# EAGLE schematic GecikmeliAnahtar (EAGLE 9.6.2)
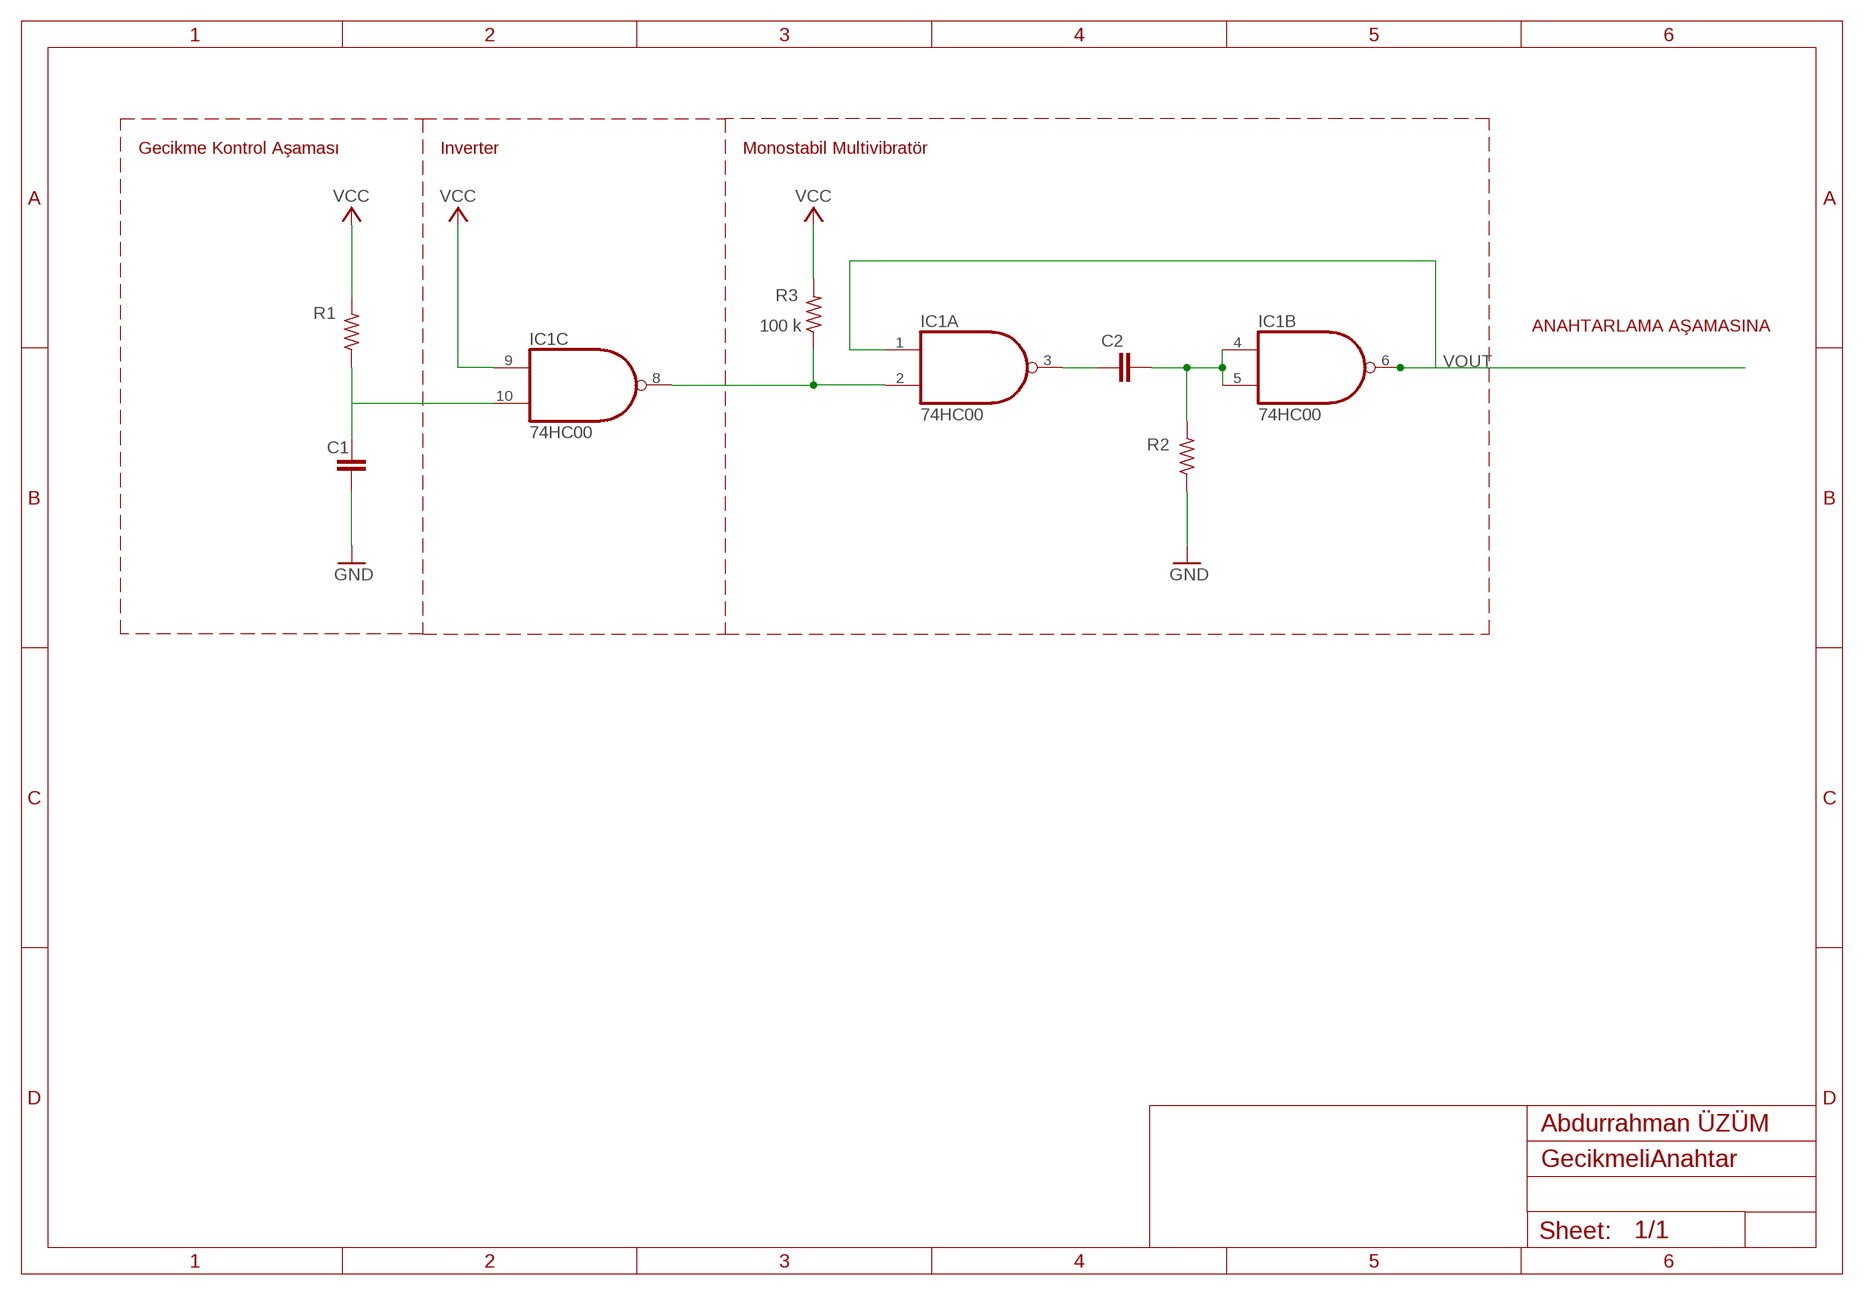
[diagram p0: schematic, sheet 1]

## Parts
C1  C-EU025-025X050  [C025-025X050]
C2  C-EU025-025X050  [C025-025X050]
IC1  74HC00  7400N  [DIL14]
R1  R-US_0207/10  [0207/10]
R2  R-US_0207/10  [0207/10]
R3  100 k  R-US_0207/10  [0207/10]

## Nets
GND: C1.2 R2.1
N$1: C2.1 IC1.3(A:O)
N$2: C2.2 IC1.4(B:I0) IC1.5(B:I1) R2.2
N$4: IC1.2(A:I1) IC1.8(C:O) R3.1
N$6: C1.1 IC1.10(C:I1) R1.1
VCC: IC1.9(C:I0) R1.2 R3.2
VOUT: IC1.1(A:I0) IC1.6(B:O)
Unconnected: IC1.11(D:O) IC1.12(D:I0) IC1.13(D:I1)

## Notes on the sheet
- Gecikme Kontrol Aşaması | Inverter | Monostabil Multivibratör
- ANAHTARLAMA AŞAMASINA
- Abdurrahman ÜZÜM

## Power pins joined to a net without a drawn wire
GND: IC1.7(P:GND)
VCC: IC1.14(P:VCC)

## Library data of the parts
C1 C2 = rcl:C-EU: CAPACITOR, European symbol; SPICEPREFIX: C
IC1 = 74xx-us:74*00: Quad 2-input NAND gate
R1-R3 = rcl:R-US_: RESISTOR, American symbol; SPICEPREFIX: R